# EAGLE design dam (EAGLE 7.4.0)
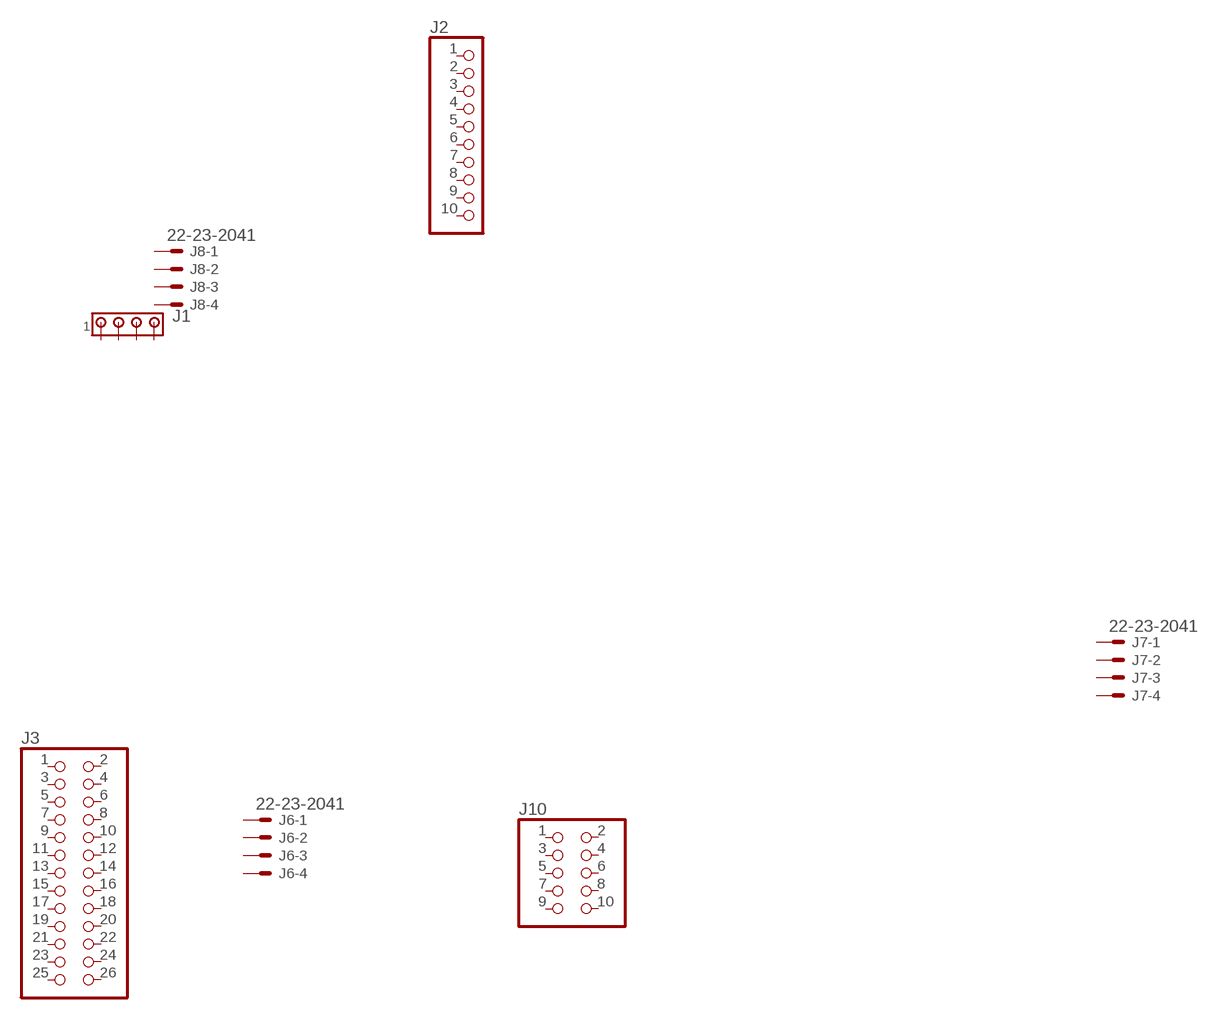
[diagram p0: schematic, sheet 1]

## Parts
J1  MTA04-156  [1X4MTA]
J2  PINHD-1X10  [1X10]
J3  PINHD-2X13  [2X13]
J6  22-23-2041  [22-23-2041]
J7  22-23-2041  [22-23-2041]
J8  22-23-2041  [22-23-2041]
J10  PINHD-2X5  [2X05]
Unconnected: J1.1 J1.2 J1.3 J1.4 J2.1 J2.2 J2.3 J2.4 J2.5 J2.6 J2.7 J2.8 J2.9 J2.10 J3.1 J3.2 J3.3 J3.4 J3.5 J3.6 J3.7 J3.8 J3.9 J3.10 J3.11 J3.12 J3.13 J3.14 J3.15 J3.16 J3.17 J3.18 J3.19 J3.20 J3.21 J3.22 J3.23 J3.24 J3.25 J3.26 J6.1 J6.2 J6.3 J6.4 J7.1 J7.2 J7.3 J7.4 J8.1 J8.2 J8.3 J8.4 J10.1 J10.2 J10.3 J10.4 J10.5 J10.6 J10.7 J10.8 J10.9 J10.10

## Library data of the parts
J1 = con-amp:MTA04-156: AMP connector
J2 = pinhead:PINHD-1X10: PIN HEADER
J3 = pinhead:PINHD-2X13: PIN HEADER
J6-J8 = con-molex:22-23-2041: .100" (2.54mm) Center Header - 4 Pin; MF: MOLEX; MPN: 22-23-2041; OC_FARNELL: 1462920; OC_NEWARK: 38C0355
J10 = pinhead:PINHD-2X5: PIN HEADER

## Board
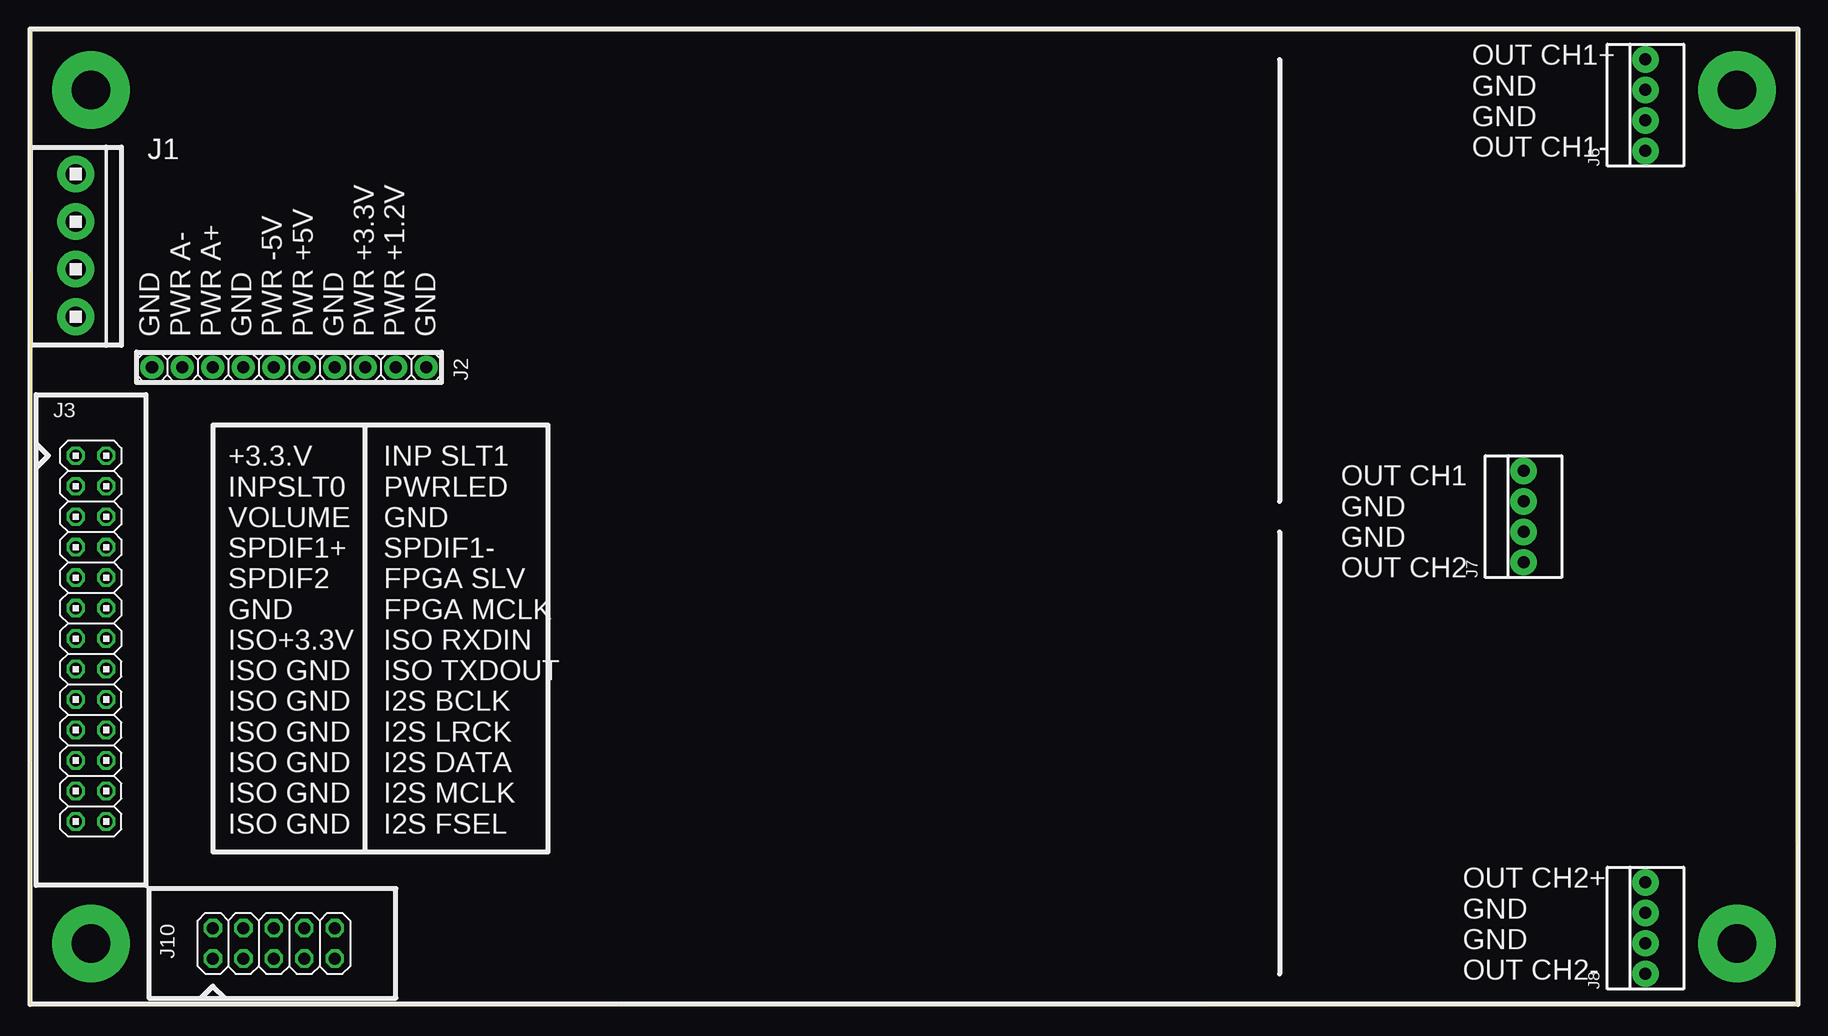
[diagram p1: board, top side]

Size 147.31 x 81.31 mm. Coordinates in mm from the lower left corner, seen from the top.
Outline: 0,0.12 147.19,0 147.31,81.2 0.12,81.31 0,0.12
Copper layers (1*16): Top 0.035mm / dielectric 1.5mm / Bottom 0.035mm
Design rules "default": minimum track width 10mil, minimum drill 24mil, track to track 8mil, track to pad 8mil, pad to pad 8mil, via to via 8mil, smd to smd 8mil, copper to edge 40mil, drill to drill 8mil, minimum pad ring 10mil, minimum via ring 8mil, stop-mask expansion 4mil, vias tented up to drill 0mil, thermal gap 10mil

### Footprints (pad centres in the part's own frame; a part is rotated, then mirrored left to right if it is on the bottom)
1X4MTA = drill 1.676 pad 3.048: 1 5.944,0; 2 1.981,0; 3 -1.981,0; 4 -5.944,0
1X10 = drill 1.016 pad 1.93: 1 -11.43,0; 2 -8.89,0; 3 -6.35,0; 4 -3.81,0; 5 -1.27,0; 6 1.27,0; 7 3.81,0; 8 6.35,0; 9 8.89,0; 10 11.43,0
2X13 = drill 1.016 octagon: 1 -15.24,-1.27; 2 -15.24,1.27; 3 -12.7,-1.27; 4 -12.7,1.27; 5 -10.16,-1.27; 6 -10.16,1.27; 7 -7.62,-1.27; 8 -7.62,1.27; 9 -5.08,-1.27; 10 -5.08,1.27; 11 -2.54,-1.27; 12 -2.54,1.27; 13 0,-1.27; 14 0,1.27; 15 2.54,-1.27; 16 2.54,1.27; 17 5.08,-1.27; 18 5.08,1.27; 19 7.62,-1.27; 20 7.62,1.27; 21 10.16,-1.27; 22 10.16,1.27; 23 12.7,-1.27; 24 12.7,1.27; 25 15.24,-1.27; 26 15.24,1.27
22-23-2041 = drill 1 pad 2.184: 1 -3.81,0; 2 -1.27,0; 3 1.27,0; 4 3.81,0
2X05 = drill 1.016 octagon: 1 -5.08,-1.27; 2 -5.08,1.27; 3 -2.54,-1.27; 4 -2.54,1.27; 5 0,-1.27; 6 0,1.27; 7 2.54,-1.27; 8 2.54,1.27; 9 5.08,-1.27; 10 5.08,1.27

### Placement (x,y rotation side)
J1  3.81,63.36 270 top
J2  21.59,53.2 0 top
J3  5.08,30.6 90 top
J6  134.62,75.05 90 top
J7  124.46,40.76 90 top
J8  134.62,6.47 90 top
J10  20.32,5.2 0 top

### Tracks (layer width: path | path; a pad name or v marks a point on that pad's centre or on a via)
N$1  (via drill 3.2 pad 6.45)
  other vias: 142.24,76.32
N$2  (via drill 3.2 pad 6.45)
  other vias: 142.24,5.2
N$3  (via drill 3.2 pad 6.45)
  other vias: 5.08,5.2
N$4  (via drill 3.2 pad 6.45)
  other vias: 5.08,76.32

### Text on the board
tPlace: OUT CH1+ / GND / GND / OUT CH1- | GND / PWR A- / PWR A+ / GND / PWR -5V / PWR +5V / GND / PWR +3.3V / PWR +1.2V / GND | OUT CH1 / GND / GND / OUT CH2 | +3.3.V / INPSLT0 / VOLUME / SPDIF1+ / SPDIF2 / GND / ISO+3.3V / ISO GND / ISO GND / ISO GND / ISO GND / ISO GND / ISO GND | INP SLT1 / PWRLED / GND / SPDIF1- / FPGA SLV / FPGA MCLK / ISO RXDIN / ISO TXDOUT / I2S BCLK / I2S LRCK / I2S DATA / I2S MCLK / I2S FSEL | OUT CH2+ / GND / GND / OUT CH2-